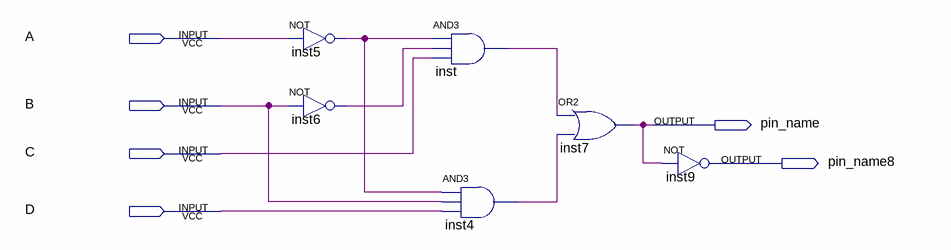
[diagram p0: schematic sheet]
// Quartus schematic preparacaoteste.bdf as structural Verilog: 6 symbols, 6 pins
module preparacaoteste (
  input  A,
  input  B,
  input  C,
  input  D,
  output pin_name,
  output pin_name8
);

  wire inst4_out, inst5_out, inst6_out, inst_out;

  not inst5 (inst5_out, A);
  not inst6 (inst6_out, B);
  and inst (inst_out, inst5_out, inst6_out, C);
  and inst4 (inst4_out, inst5_out, B, D);
  or inst7 (pin_name, inst_out, inst4_out);
  not inst9 (pin_name8, pin_name);
endmodule
